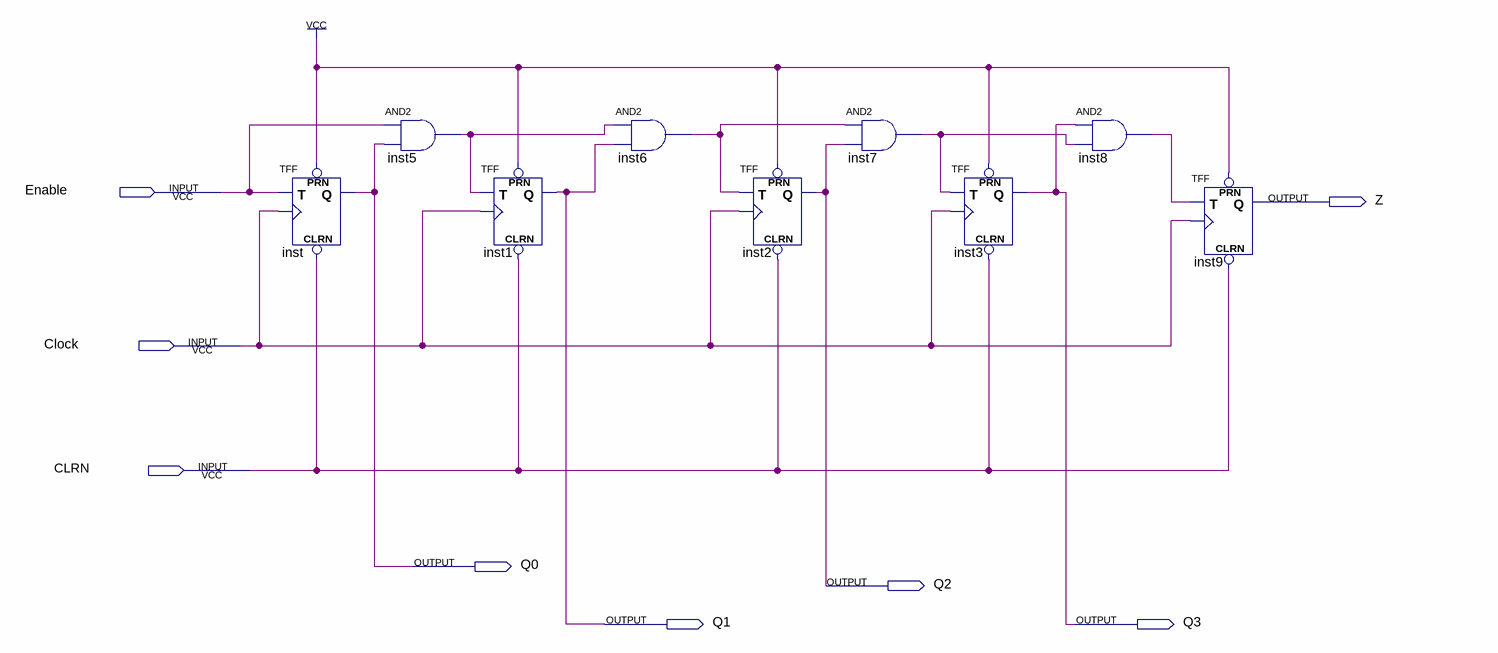
[diagram p0: schematic sheet]
// Quartus schematic lab10step2b.bdf as structural Verilog: 9 symbols, 8 pins
module lab10step2b (
  input  Enable,
  input  Clock,
  input  CLRN,
  output Z,
  output Q0,
  output Q2,
  output Q1,
  output Q3
);

  wire inst5_out, inst6_out, inst7_out, inst8_out;

  TFF inst (.PRN(1'b1), .CLRN(CLRN), .T(Enable), .CLK(Clock), .Q(Q0));
  and inst5 (inst5_out, Enable, Q0);
  TFF inst1 (.PRN(1'b1), .CLRN(CLRN), .T(inst5_out), .CLK(Clock), .Q(Q1));
  and inst6 (inst6_out, inst5_out, Q1);
  TFF inst2 (.PRN(1'b1), .CLRN(CLRN), .T(inst6_out), .CLK(Clock), .Q(Q2));
  and inst7 (inst7_out, inst6_out, Q2);
  TFF inst3 (.PRN(1'b1), .CLRN(CLRN), .T(inst7_out), .CLK(Clock), .Q(Q3));
  and inst8 (inst8_out, Q3, inst7_out);
  TFF inst9 (.PRN(1'b1), .CLRN(CLRN), .T(inst8_out), .CLK(Clock), .Q(Z));
endmodule
